# Altium schematic sheet Reference.SchDoc
size A; SheetNumber: 6; SheetTotal: 6
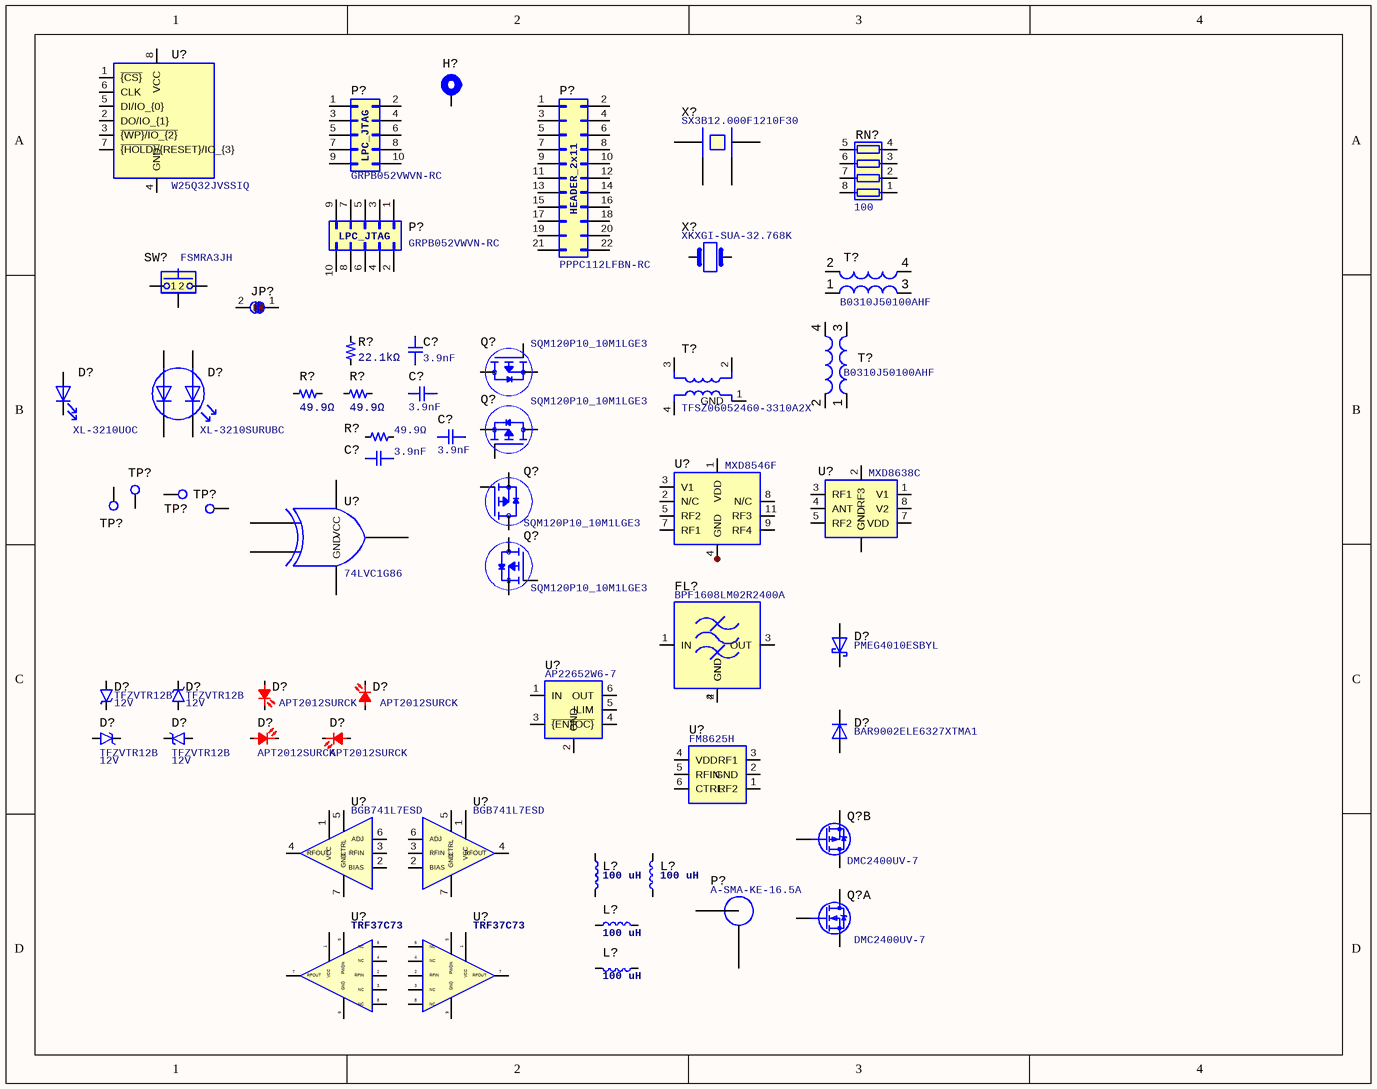
[diagram p0: Reference.SchDoc]

## Parts
(Parts that share a designator on the sheet are numbered #1, #2 ... from top to bottom, then left to right.)
C?#1  Capacitance: 3.9nF  [CAPC0805(2012)145_L]  (hidden comment: MN-CAP-CERM-C0G-0805-3.9nF-50V-5%)
C?#2  Capacitance: 3.9nF  [CAPC0805(2012)145_L]  (hidden comment: MN-CAP-CERM-C0G-0805-3.9nF-50V-5%)
C?#3  Capacitance: 3.9nF  [CAPC0805(2012)145_L]  (hidden comment: MN-CAP-CERM-C0G-0805-3.9nF-50V-5%)
C?#4  Capacitance: 3.9nF  [CAPC0805(2012)145_L]  (hidden comment: MN-CAP-CERM-C0G-0805-3.9nF-50V-5%)
D?#1  Part Number: XL-3210UOC  [LED_Single_Xinglight_XL-3210_Horizontal]  (hidden comment: LED)
D?#2  Part Number: XL-3210SURUBC  [LED_Dual_Xinglight_XL-3210_Horizontal]  (hidden comment: LED)
D?#3  Part Number: PMEG4010ESBYL  [TSLP-2-19]  (hidden comment: Schottky)
D?#4  PartNumber: TFZVTR12B  Zener Voltage: 12V  [SOD-323HE]  (hidden comment: MN-DIO-ZENER-12V)
D?#5  PartNumber: APT2012SURCK  [LEDC2012X05N]  (hidden comment: MN-LED-0805-RED)
D?#6  PartNumber: TFZVTR12B  Zener Voltage: 12V  [SOD-323HE]  (hidden comment: MN-DIO-ZENER-12V)
D?#7  PartNumber: APT2012SURCK  [LEDC2012X05N]  (hidden comment: MN-LED-0805-RED)
D?#8  Part Number: BAR9002ELE6327XTMA1  [TSLP-2-19]  (hidden comment: PIN)
D?#9  PartNumber: TFZVTR12B  Zener Voltage: 12V  [SOD-323HE]  (hidden comment: MN-DIO-ZENER-12V)
D?#10  PartNumber: TFZVTR12B  Zener Voltage: 12V  [SOD-323HE]  (hidden comment: MN-DIO-ZENER-12V)
D?#11  PartNumber: APT2012SURCK  [LEDC2012X05N]  (hidden comment: MN-LED-0805-RED)
D?#12  PartNumber: APT2012SURCK  [LEDC2012X05N]  (hidden comment: MN-LED-0805-RED)
FL?  Part Number: BPF1608LM02R2400A  [Filter_Pulse_BPF1608LM09R5000A]  (hidden comment: BPF)
H?  MountingHole_Pad  [MountingHole_3.2mm_M3_Pad_Via]  (value not drawn)
JP?  SolderJumper_2_Bridged  [SolderJumper-2_P1.3mm_Bridged_RoundedPad1.0x1.5mm]  (value not drawn)  (graphical)
L?#1  100 uH  [L_TDK_MLZ2012_h1.25mm]
L?#2  100 uH  [L_TDK_MLZ2012_h1.25mm]
L?#3  100 uH  [L_TDK_MLZ2012_h1.25mm]
L?#4  100 uH  [L_TDK_MLZ2012_h1.25mm]
P?#1  Part Number: GRPB052VWVN-RC  [PinHeader_2x05_P1.27mm_Vertical]  (hidden comment: LPC_JTAG)
P?#2  Part Number: PPPC112LFBN-RC  [PinSocket_2x11_P2.54mm_Vertical_Flipped]  (hidden comment: HEADER_2x11)
P?#3  Part Number: GRPB052VWVN-RC  [PinHeader_2x05_P1.27mm_Vertical]  (hidden comment: LPC_JTAG)
P?#4  Part Number: A-SMA-KE-16.5A  [SMA_MyAntenna_A-SMA-KE-16.5A_EdgeMount]  (hidden comment: SMA)
Q?#1  PartNumber: SQM120P10_10M1LGE3  [FP-T13-0707-MFG]  (hidden comment: MN-TRN-MOSFET-P_CH-100V-120A-SQM120P10_10M1LGE3)
Q?#2  PartNumber: SQM120P10_10M1LGE3  [FP-T13-0707-MFG]  (hidden comment: MN-TRN-MOSFET-P_CH-100V-120A-SQM120P10_10M1LGE3)
Q?#3  PartNumber: SQM120P10_10M1LGE3  [FP-T13-0707-MFG]  (hidden comment: MN-TRN-MOSFET-P_CH-100V-120A-SQM120P10_10M1LGE3)
Q?#4  PartNumber: SQM120P10_10M1LGE3  [FP-T13-0707-MFG]  (hidden comment: MN-TRN-MOSFET-P_CH-100V-120A-SQM120P10_10M1LGE3)
Q?#5  Part Number: DMC2400UV-7  [SOT-563]  (hidden comment: NMOS/PMOS)  (part B of 2)
Q?#6  Part Number: DMC2400UV-7  [SOT-563]  (hidden comment: NMOS/PMOS)  (part A of 2)
R?#1  Resistance: 22.1kΩ  [RESC0402(1005)]  (hidden comment: MN-RES-0402-22.1KΩ-1/10W)
R?#2  Resistance: 49.9Ω  [RESC0402(1005)]  (hidden comment: MN-RES-0402-49.9Ω-1/16W)
R?#3  Resistance: 49.9Ω  [RESC0402(1005)]  (hidden comment: MN-RES-0402-49.9Ω-1/16W)
R?#4  Resistance: 49.9Ω  [RESC0402(1005)]  (hidden comment: MN-RES-0402-49.9Ω-1/16W)
RN?  100  [R_Array_Convex_4x0402]
SW?  Part Number: FSMRA3JH  [SW_Tactile_SPST_Angled_PTS645Vx58-2LFS]  (hidden comment: SWITCH)
T?#1  Part Number: B0310J50100AHF  [Anaren_0805_2012Metric-6]  (hidden comment: RF_BALUN)
T?#2  Part Number: B0310J50100AHF  [Anaren_0805_2012Metric-6]  (hidden comment: RF_BALUN)
T?#3  IF_BALUN  [Balun_TDK_TFSZ06052460-3310A2X]  (value not drawn)
TP?#1  TestPoint  [TestPoint_Pad_D1.0mm]  (value not drawn)
TP?#2  TestPoint  [TestPoint_Pad_D1.0mm]  (value not drawn)
TP?#3  TestPoint  [TestPoint_Pad_D1.0mm]  (value not drawn)
TP?#4  TestPoint  [TestPoint_Pad_D1.0mm]  (value not drawn)
U?#1  Part Number: W25Q32JVSSIQ  [SOIC-8_5.3x5.3mm_P1.27mm]  (hidden comment: W25Q32)
U?#2  MXD8638C  [MXD8638C]
U?#3  MXD8546F  [QFN-12-1EP_2x2mm_P0.5mm_EP1x1mm]
U?#4  74LVC1G86  [SOT-353_SC-70-5]
U?#5  Part Number: AP22652W6-7  [TSOP-6_1.65x3.05mm_P0.95mm]  (hidden comment: AP22652)
U?#6  FM8625H  [TSLP-6-4_1.1x0.7mm_P0.4mm]
U?#7  BGB741L7ESD  [TSLP-7-1]
U?#8  BGB741L7ESD  [TSLP-7-1]
U?#9  TRF37C73  [WSON-8-1EP_2x2mm_P0.5mm_EP0.9x1.6mm]
U?#10  TRF37C73  [WSON-8-1EP_2x2mm_P0.5mm_EP0.9x1.6mm]
X?#1  Part Number: SX3B12.000F1210F30  [Crystal_SMD_3225-4Pin_3.2x2.5mm]  (hidden comment: MCU_XTAL)
X?#2  Part Number: XKXGI-SUA-32.768K  [Crystal_SMD_3215-2Pin_3.2x1.5mm]  (hidden comment: RTC_XTAL)

## Nets
NetFL?_2: FL?.2(GND) FL?.4(GND)
NetU?#2_6: U?#2.6(GND) U?#2.9(GND)
NetU?#3_4: U?#3.4(GND) U?#3.6(GND) U?#3.10(GND) U?#3.12(GND) U?#3.13(GND)

Not connected (* = marked no-connect by the designer): C?#1 1 2; C?#2 1 2; C?#3 1 2; C?#4 1 2; D?#1 1(K) 2(A); D?#2 1(A1) 2(K1) 3(A2) 4(K2); D?#3 1(K) 2(A); D?#4 1(K) 2(A); D?#5 A K; D?#6 1(K) 2(A); D?#7 A K; D?#8 1(K) 2(A); D?#9 1(K) 2(A); D?#10 1(K) 2(A); D?#11 A K; D?#12 A K; FL? 1(IN) 3(OUT); H? 1; JP? 1(A) 2(B); L?#1 1 2; L?#2 1 2; L?#3 1 2; L?#4 1 2; P?#1 1(Pin_1) 2(Pin_2) 3(Pin_3) 4(Pin_4) 5(Pin_5) 6(Pin_6) 7(Pin_7) 8(Pin_8) 9(Pin_9) 10(Pin_10); P?#2 1(Pin_1) 2(Pin_2) 3(Pin_3) 4(Pin_4) 5(Pin_5) 6(Pin_6) 7(Pin_7) 8(Pin_8) 9(Pin_9) 10(Pin_10) 11(Pin_11) 12(Pin_12) 13(Pin_13) 14(Pin_14) 15(Pin_15) 16(Pin_16) 17(Pin_17) 18(Pin_18) 19(Pin_19) 20(Pin_20) 21(Pin_21) 22(Pin_22); P?#3 1(Pin_1) 2(Pin_2) 3(Pin_3) 4(Pin_4) 5(Pin_5) 6(Pin_6) 7(Pin_7) 8(Pin_8) 9(Pin_9) 10(Pin_10); P?#4 1(RF) 2(GND); Q?#1 D G S; Q?#2 D G S; Q?#3 D G S; Q?#4 D G S; Q?#5 3(D) 4(S) 5(G); Q?#6 1(S) 2(G) 6(D); R?#1 1 2; R?#2 1 2; R?#3 1 2; R?#4 1 2; RN? 1(R1.1) 2(R2.1) 3(R3.1) 4(R4.1) 5(R4.2) 6(R3.2) 7(R2.2) 8(R1.2); SW? 1 2 SH(B); T?#1 1(S1) 2(S2) 3(PR1) 4(PR2); T?#2 1(S1) 2(S2) 3(PR1) 4(PR2); T?#3 1(GND) 2 3 4; TP?#1 1; TP?#2 1; TP?#3 1; TP?#4 1; U?#1 1(~{{CS}}) 2(DO/IO_{1}) 3(~{{WP}/IO_{2}}) 4(GND) 5(DI/IO_{0}) 6(CLK) 7(~{{HOLD}/}{RESET}/IO_{3}) 8(VCC); U?#2 1(V1) 2(RF3) 3(RF1) 4(ANT) 5(RF2) 7(VDD) 8(V2); U?#3 1(VDD) 2(N/C) 3(V1) 5(RF2) 7(RF1) 8(N/C) 9(RF4) 11(RF3); U?#4 1 2 3(GND) 4 5(VCC); U?#5 1(IN) 2(GND) 3(~{{EN}}) 4(~{{OC}}) 5(ILIM) 6(OUT); U?#6 1(RF2) 2(GND) 3(RF1) 4(VDD) 5(RFIN) 6(CTRL); U?#7 1(VCC) 2(BIAS) 3(RFIN) 4(RFOUT) 5(CTRL) 6(ADJ) 7(GND); U?#8 1(VCC) 2(BIAS) 3(RFIN) 4(RFOUT) 5(CTRL) 6(ADJ) 7(GND); U?#9 1(VCC) 2(RFIN) 3(NC) 4(NC) 5(PWDN) 6(NC) 7(RFOUT) 8(NC) 9(GND); U?#10 1(VCC) 2(RFIN) 3(NC) 4(NC) 5(PWDN) 6(NC) 7(RFOUT) 8(NC) 9(GND); X?#1 1 2 3 4; X?#2 1 2

## Library data of the parts
C?#1 C?#3 = CMP-001-00091-10: CAP, CERM, 3.9 nF, 50 V, +/-5%, 0805, C0G; PartNumber: CGA4C2C0G1H392J060AA; Value: 3.9nF
C?#2 = CMP-001-00091-10: CAP, CERM, 3.9 nF, 50 V, +/-5%, 0805, C0G; PartNumber: CGA4C2C0G1H392J060AA; Value: 3.9nF; sch_layout_opt: 1
C?#4 = CMP-001-00091-10: CAP, CERM, 3.9 nF, 50 V, +/-5%, 0805, C0G; PartNumber: CGA4C2C0G1H392J060AA; Value: 3.9nF; sch_layout_opt: 2
D?#1 = LED: Manufacturer: Xinglight; Sim.Pins: 1=K 2=A; Value: LED; Footprint: praline:LED_Single_Xinglight_XL-3210_Horizontal
D?#2 = LED_Dual_AKAK: Manufacturer: Xinglight; Value: LED; Footprint: praline:LED_Dual_Xinglight_XL-3210_Horizontal
D?#3 = D_Schottky: Manufacturer: Nexperia; Value: Schottky; Footprint: praline:TSLP-2-19
D?#4 D?#6 D?#9 D?#10 = CMP-039-000002-6: TFZVTR12B Series 12 V 500 mW Surface Mount Zener Diode - TUMD2M
D?#5 D?#7 D?#11 D?#12 = CMP-039-000000-10: LED Uni-Color Red 645nm 2-Pin Chip 0805(2012Metric) T/R; Forward Current: 30mA; Forward Voltage: 2.5V; Lens Style: Clear; Luminous Intensity: 150mcd; Peak Wavelength: 650nm; Power Rating: 75mW; Viewing Angle: 120°; Wavelength: 635nm; Case Code (Imperial): 0805; Case Code (Metric): 2012; Case/Package: 0805; Color: Red; Height: 750µm; Illumination Color: Red; Length: 2mm; Mounting Technology: Surface Mount; Terminal Pitch: 2.35mm; Width: 1.25mm
D?#8 = D: Manufacturer: Infineon; Value: PIN; Footprint: praline:TSLP-2-19
FL? = BFCN-1445: Manufacturer: Pulse Electronics; Value: BPF; Footprint: praline:Filter_Pulse_BPF1608LM09R5000A
L?#1-L?#4 = L: Manufacturer: TDK; Part Number: MLZ2012N101LT000; Substitution: MLZ2012N101LTD25; Value: 100 uH; Footprint: praline:L_TDK_MLZ2012_h1.25mm; Inductance: *
P?#1 P?#3 = Conn_02x05_Odd_Even: Manufacturer: Sullins; Value: LPC_JTAG; Footprint: Connector_PinHeader_1.27mm:PinHeader_2x05_P1.27mm_Vertical
P?#2 = Conn_02x11_Odd_Even: Manufacturer: Sullins; Value: HEADER_2x11; Footprint: praline:PinSocket_2x11_P2.54mm_Vertical_Flipped
P?#4 = GSG-RF-CONN: Manufacturer: MyAntenna; Substitution: M04-0102170R0A; Value: SMA; Footprint: praline:SMA_MyAntenna_A-SMA-KE-16.5A_EdgeMount
Q?#1-Q?#4 = CMP-044-000000-5: Trans MOSFET P-CH 100V 120A Automotive AEC-Q101 3-Pin(2+Tab) D2PAK
Q?#5 Q?#6 = Q_Dual_NMOS_PMOS_S1G1D2S2G2D1: Manufacturer: Diodes Inc.; Substitution: DMC2400UV*; Value: NMOS/PMOS; Footprint: Package_TO_SOT_SMD:SOT-563
R?#1 = CMP-009-00190-9: Resistor, 22.1KΩ, 1%, 1/10W (100mW), 0402; PartNumber: CRCW040222K1FKED; Value: 22.1kΩ
R?#2 = CMP-009-00191-9: Resistor, 49.9Ω, 1%, 1/16W (66mW), 0402; PartNumber: CRCW040249R9FKED
R?#3 = CMP-009-00191-9: Resistor, 49.9Ω, 1%, 1/16W (66mW), 0402; PartNumber: CRCW040249R9FKED; sch_layout_opt: 1
R?#4 = CMP-009-00191-9: Resistor, 49.9Ω, 1%, 1/16W (66mW), 0402; PartNumber: CRCW040249R9FKED; sch_layout_opt: 2
RN? = R_Pack04: Manufacturer: Yageo; Part Number: YC124-JR-07100RL; Substitution: any equivalent; Value: 100; Footprint: Resistor_SMD:R_Array_Convex_4x0402
SW? = SW_Push_Shielded: Manufacturer: TE Connectivity; Value: SWITCH; Footprint: praline:SW_Tactile_SPST_Angled_PTS645Vx58-2LFS
T?#1 T?#2 = BALUN-B0310J50100AHF: Manufacturer: TTM; Value: RF_BALUN; Footprint: RF_Converter:Anaren_0805_2012Metric-6
T?#3 = TFSZ06052460-3310A2X: Manufacturer: TDK; Part Number: TFSZ06052460-3310A2X; Value: IF_BALUN; Footprint: praline:Balun_TDK_TFSZ06052460-3310A2X
U?#1 = W25Q32JVSS: Manufacturer: Winbond; Value: W25Q32; Footprint: Package_SO:SOIC-8_5.3x5.3mm_P1.27mm
U?#2 = MXD8638: Manufacturer: Maxscend; Part Number: MXD8638C; Value: MXD8638C; Footprint: praline:MXD8638C
U?#3 = MXD8546F: Manufacturer: Maxscend; Part Number: MXD8546F; Value: MXD8546F; Footprint: praline:QFN-12-1EP_2x2mm_P0.5mm_EP1x1mm
U?#4 = 74LVC1G86: Manufacturer: UMW; Part Number: SN74LVC1G86DCKR; Substitution: TI SN74LVC1G86DCKR; Value: 74LVC1G86; Footprint: Package_TO_SOT_SMD:SOT-353_SC-70-5
U?#5 = BD2243G: Manufacturer: Diodes Inc.; Value: AP22652; Footprint: Package_SO:TSOP-6_1.65x3.05mm_P0.95mm
U?#6 = BGS12P2L6: Manufacturer: Shenzhen Fuman; Part Number: FM8625H; Value: FM8625H; Footprint: praline:TSLP-6-4_1.1x0.7mm_P0.4mm
U?#7 U?#8 = BGB741L7ESD: Manufacturer: Infineon; Part Number: BGB741L7ESDE6327XTSA1; Value: BGB741L7ESD; Footprint: praline:TSLP-7-1
U?#9 U?#10 = TRF37A73: Manufacturer: Texas Instruments; Part Number: TRF37C73IDSGR; Substitution: TRF37C73*; Value: TRF37C73; Footprint: Package_SON:WSON-8-1EP_2x2mm_P0.5mm_EP0.9x1.6mm
X?#1 = GSG-XTAL4PIN: Manufacturer: Shenzhen SCTF Electronics; Value: MCU_XTAL; Footprint: praline:Crystal_SMD_3225-4Pin_3.2x2.5mm
X?#2 = Crystal: Manufacturer: YXC; Value: RTC_XTAL; Footprint: praline:Crystal_SMD_3215-2Pin_3.2x1.5mm
H? = MountingHole_Pad: Value: MountingHole_Pad; Footprint: praline:MountingHole_3.2mm_M3_Pad_Via
JP? = SolderJumper_2_Bridged: Value: SolderJumper_2_Bridged; Footprint: Jumper:SolderJumper-2_P1.3mm_Bridged_RoundedPad1.0x1.5mm
TP?#1-TP?#4 = TestPoint: Value: TestPoint; Footprint: TestPoint:TestPoint_Pad_D1.0mm